# EAGLE design RobotShieldInterfaceRevB (EAGLE 7.5.0)
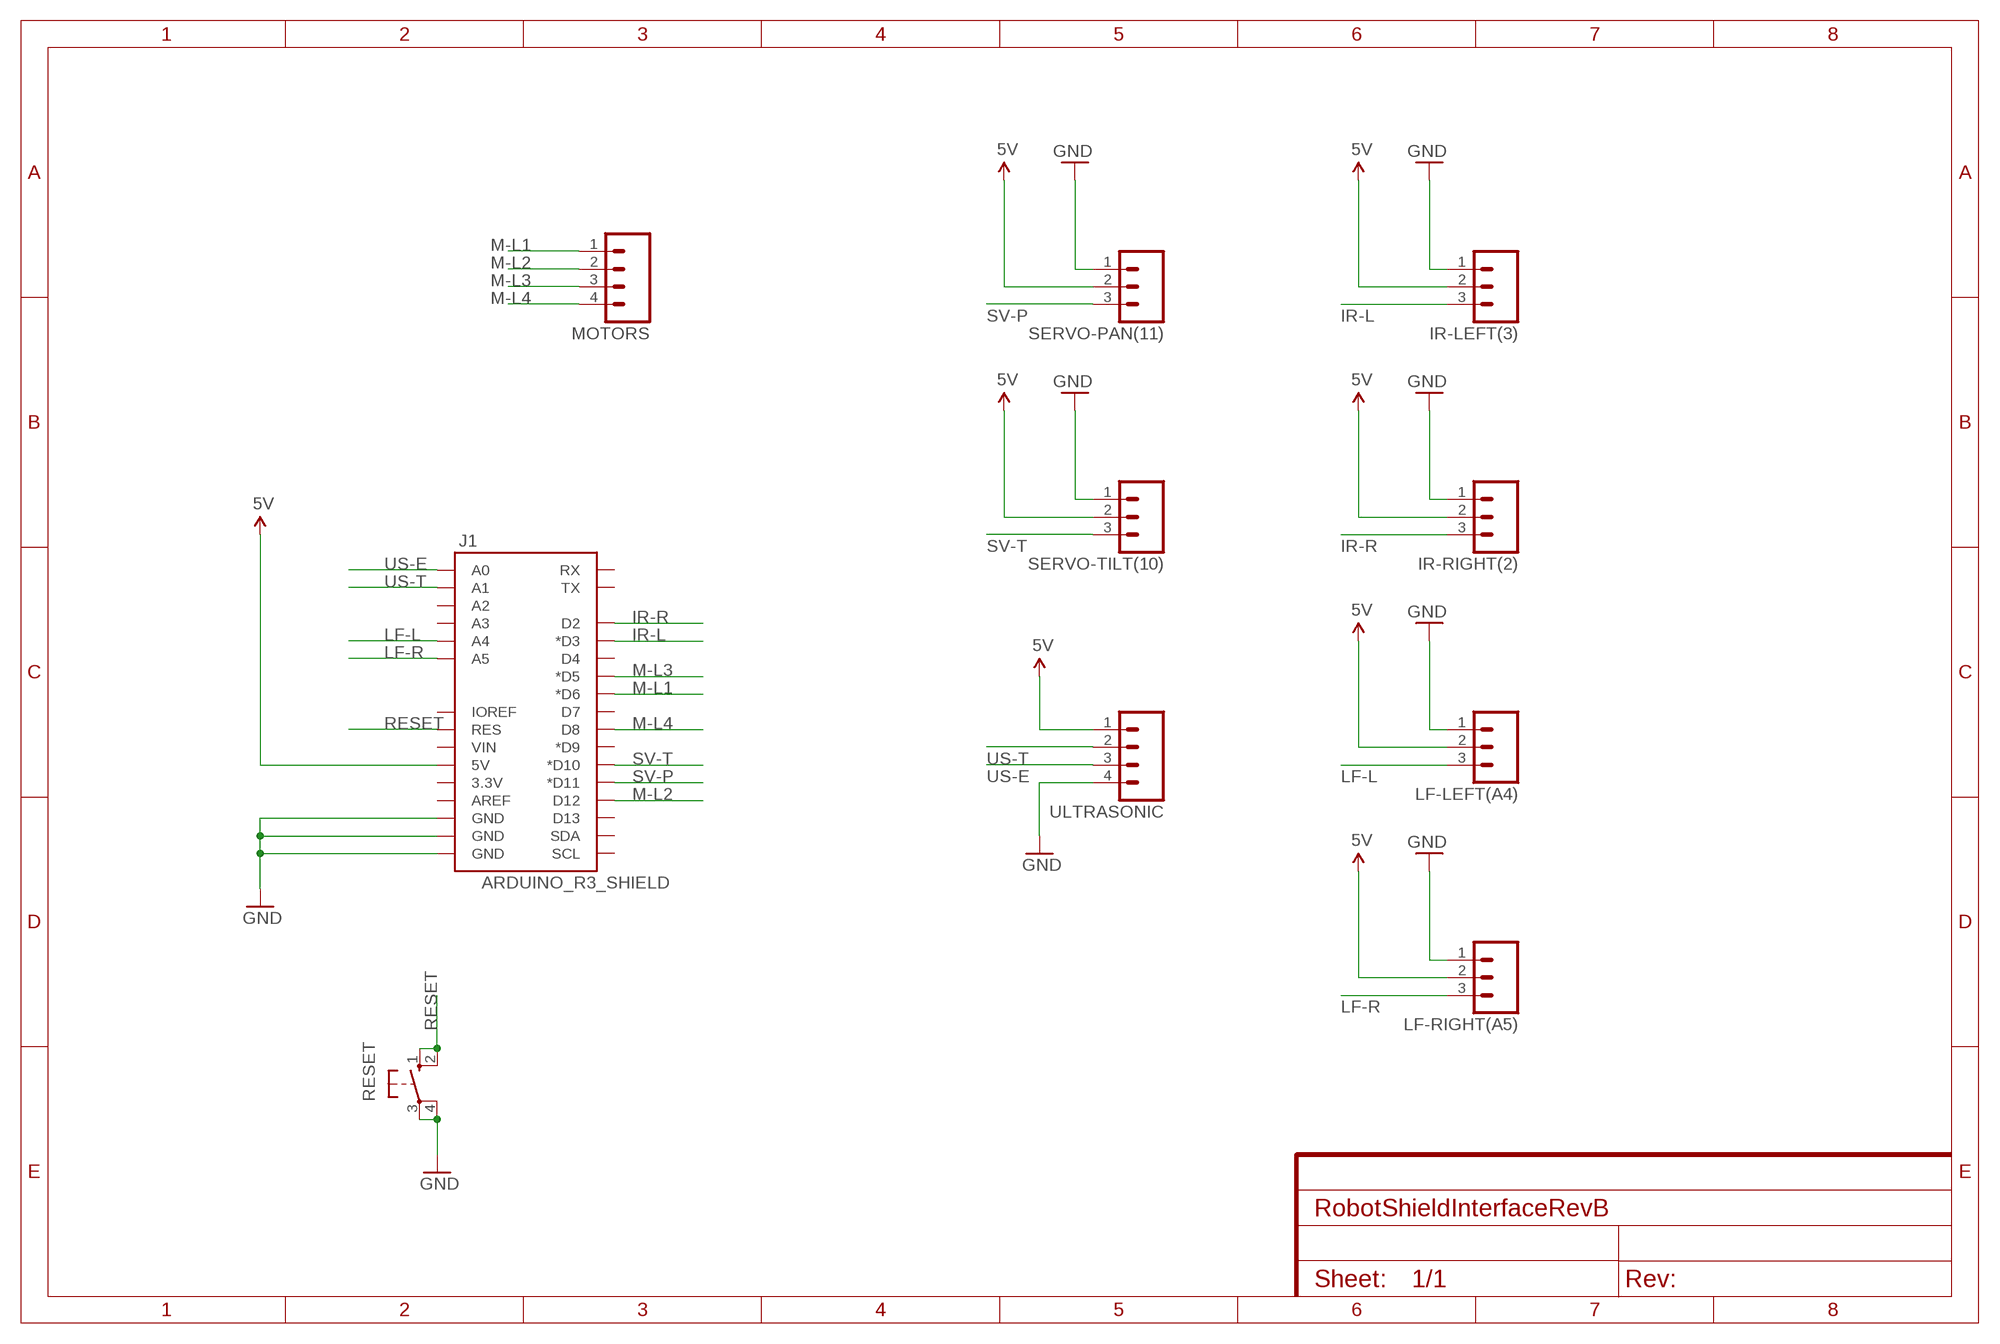
[diagram p0: schematic, sheet 1]
FRAME1 (FRAME-A4L): CNAME: Arduino Robot Interface Shield; CREVISION: B 02/2016; DESIGNER: A J Instone-Cowie

## Parts
IR-LEFT(3)  M03PTH  [1X03]
IR-RIGHT(2)  M03PTH  [1X03]
J1  ARDUINO_R3_SHIELD  [UNO_R3_SHIELD]
LF-LEFT(A4)  M03PTH  [1X03]
LF-RIGHT(A5)  M03PTH  [1X03]
MOTORS  M04PTH  [1X04]
RESET  10-XX  [B3F-10XX]
SERVO-PAN(11)  M03PTH  [1X03]
SERVO-TILT(10)  M03PTH  [1X03]
ULTRASONIC  M04PTH  [1X04]

## Nets
5V: IR-LEFT(3).2 IR-RIGHT(2).2 J1.5V LF-LEFT(A4).2 LF-RIGHT(A5).2 SERVO-PAN(11).2 SERVO-TILT(10).2 ULTRASONIC.1
GND: IR-LEFT(3).1 IR-RIGHT(2).1 J1.GND@0(GND) J1.GND@1(GND) J1.GND@2(GND) LF-LEFT(A4).1 LF-RIGHT(A5).1 RESET.3(P) RESET.4(P1) SERVO-PAN(11).1 SERVO-TILT(10).1 ULTRASONIC.4
IR-L: IR-LEFT(3).3 J1.D3(*D3)
IR-R: IR-RIGHT(2).3 J1.D2
LF-L: J1.A4 LF-LEFT(A4).3
LF-R: J1.A5 LF-RIGHT(A5).3
M-L1: J1.D6(*D6) MOTORS.1
M-L2: J1.D12 MOTORS.2
M-L3: J1.D5(*D5) MOTORS.3
M-L4: J1.D8 MOTORS.4
RESET: J1.RES RESET.1(S) RESET.2(S1)
SV-P: J1.D11(*D11) SERVO-PAN(11).3
SV-T: J1.D10(*D10) SERVO-TILT(10).3
US-E: J1.A0 ULTRASONIC.3
US-T: J1.A1 ULTRASONIC.2
Unconnected: J1.3.3V J1.A2 J1.A3 J1.AREF J1.D4 J1.D7 J1.D9(*D9) J1.D13 J1.IOREF J1.RX J1.SCL J1.SDA J1.TX J1.VIN

## Library data of the parts
IR-LEFT(3) IR-RIGHT(2) LF-LEFT(A4) LF-RIGHT(A5) SERVO-PAN(11) SERVO-TILT(10) = SparkFun-Connectors:M03: Header 3 Standard 3-pin 0.1" header. Use with straight break away headers (SKU : PRT-00116), right angle break away headers (PRT-00553), swiss pins (PRT-00743), machine pins (PRT-00117), and female headers (PRT-00115). Molex polarized connector foot print use with SKU : PRT-08232 with associated crimp pins and housings.
J1 = SparkFun-Boards:ARDUINO_R3_SHIELD: Shield form compatible with the Arduino Uno R3.
MOTORS ULTRASONIC = SparkFun-Connectors:M04: Header 4 Standard 4-pin 0.1" header. Use with straight break away headers (SKU : PRT-00116), right angle break away headers (PRT-00553), swiss pins (PRT-00743), machine pins (PRT-00117), and female headers (PRT-00115). Molex polarized connector foot print use with SKU : PRT-08231 with associated crimp pins and housings. 1MM SMD Version SKU: PRT-10208
RESET = switch-omron:10-XX: OMRON SWITCH; MPN: B3F-1000; OC_FARNELL: 176432; OC_NEWARK: 36M3542

## Board
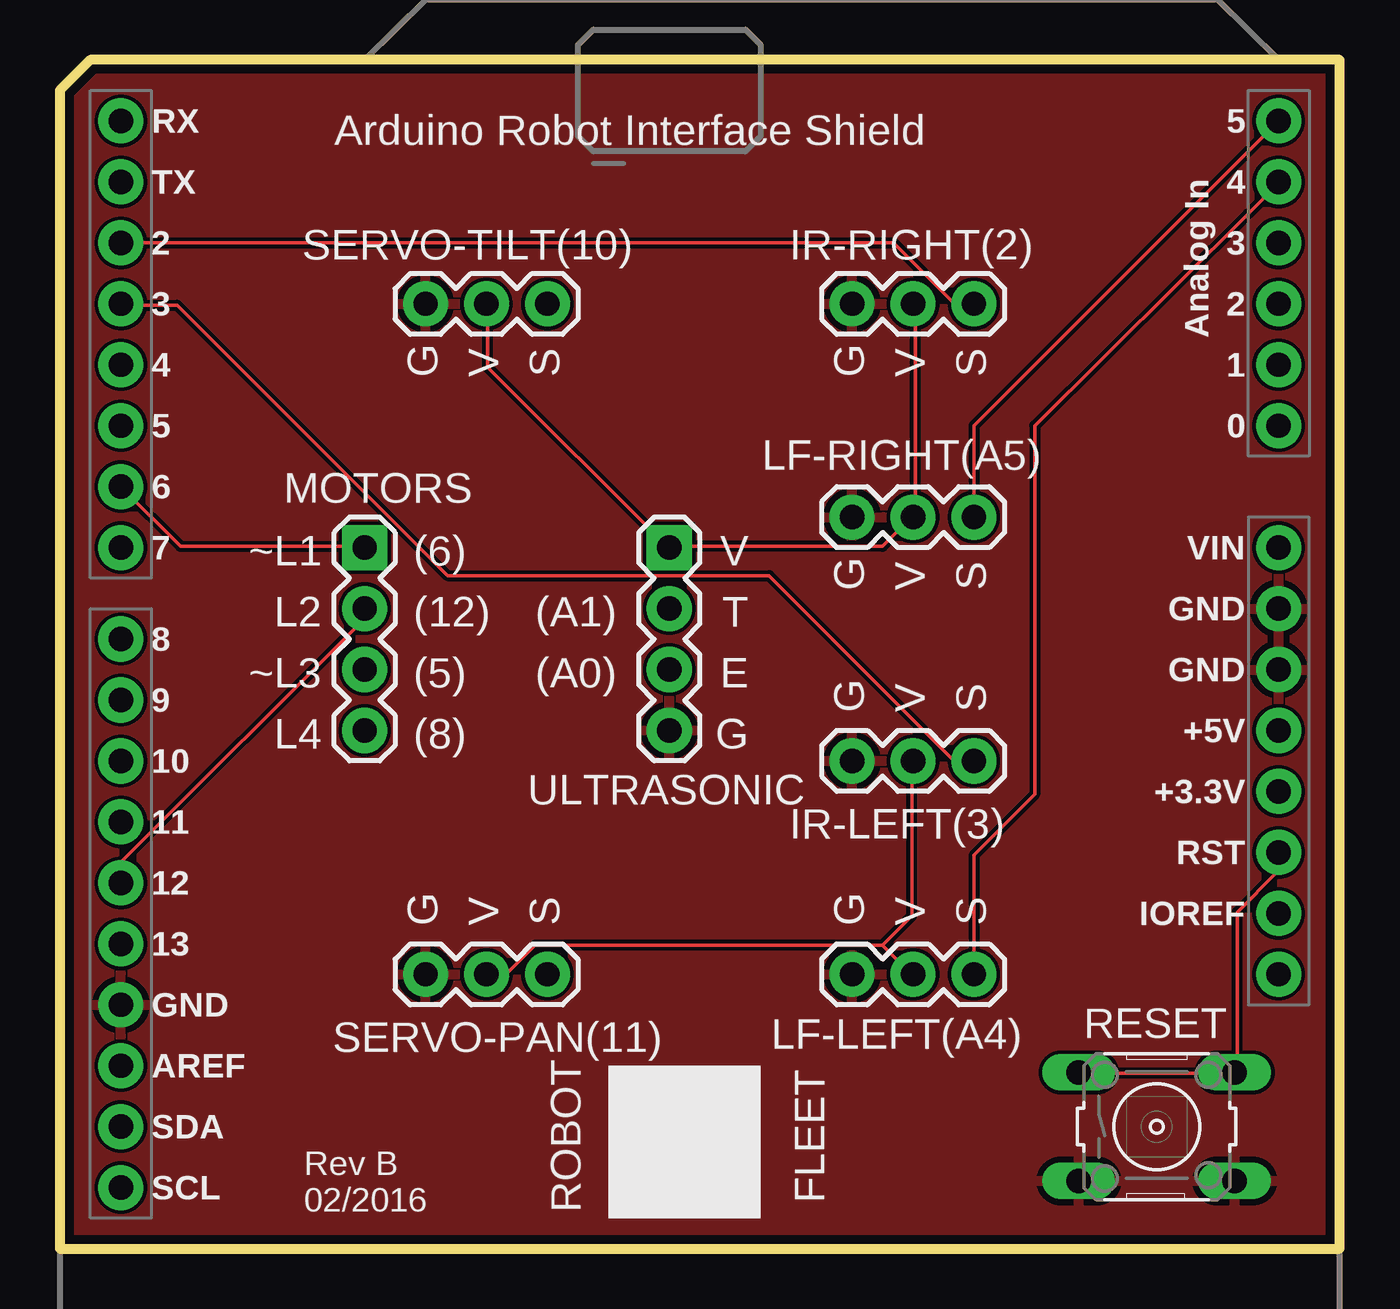
[diagram p1: board, top side]
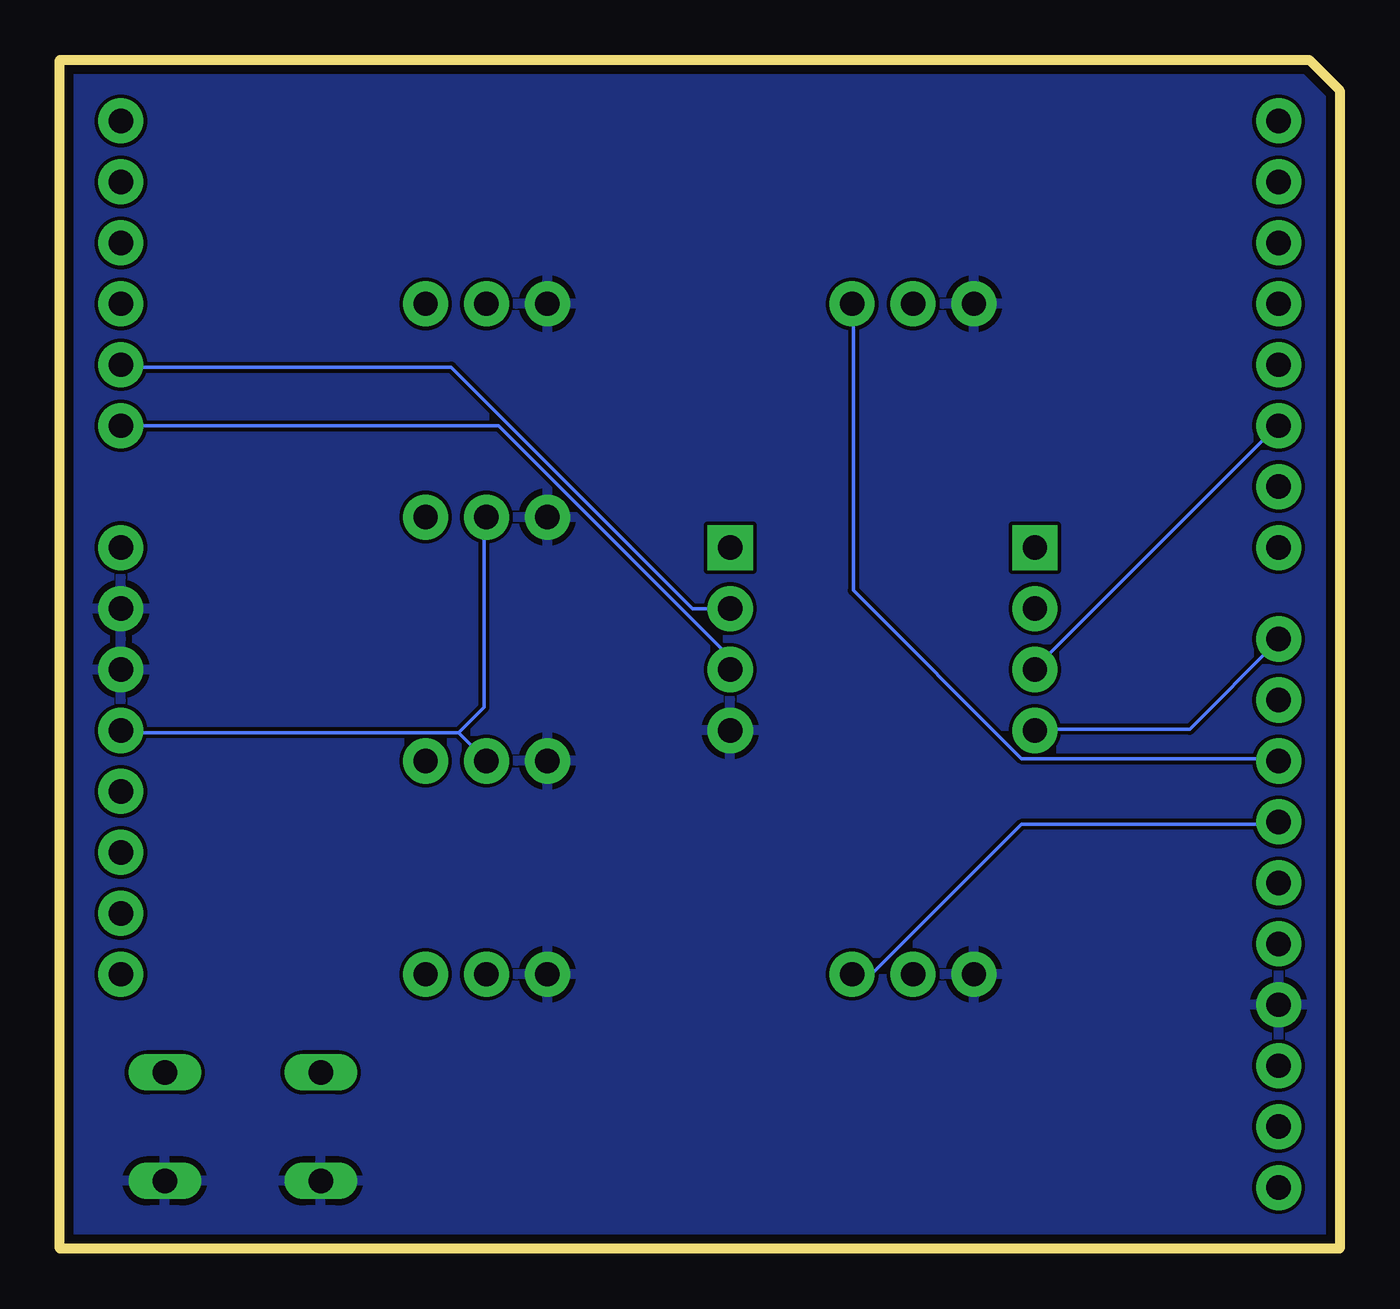
[diagram p2: board, bottom side, seen from below]

Size 53.34 x 49.53 mm. Coordinates in mm from the lower left corner, seen from the top.
Outline: 0,0 53.34,0 53.34,49.53 1.27,49.53 0,48.26 0,0
Copper layers (1*16): Top 0.0356mm / dielectric 1.5011mm / Bottom 0.0356mm
Design rules "LaenPCBOrder(OSHPARK)": minimum track width 6mil, minimum drill 13mil, track to track 6mil, track to pad 6mil, pad to pad 6mil, via to via 6mil, smd to smd 6mil, copper to edge 15mil, drill to drill 6mil, minimum pad ring 7mil, minimum via ring 7mil, stop-mask expansion 3mil, vias tented up to drill 0mil, thermal gap 10mil

### Footprints (pad centres in the part's own frame; a part is rotated, then mirrored left to right if it is on the bottom)
1X03 = drill 1.016 pad 1.88: 1 0,0; 2 2.54,0; 3 5.08,0
UNO_R3_SHIELD = drill 1.016 pad 1.88: 3.3V 50.8,26.67; 5V 50.8,29.21; A0 50.8,41.91; A1 50.8,44.45; A2 50.8,46.99; A3 50.8,49.53; A4 50.8,52.07; A5 50.8,54.61; AREF 2.54,15.24; D2 2.54,49.53; D3 2.54,46.99; D4 2.54,44.45; D5 2.54,41.91; D6 2.54,39.37; D7 2.54,36.83; D8 2.54,33.02; D9 2.54,30.48; D10 2.54,27.94; D11 2.54,25.4; D12 2.54,22.86; D13 2.54,20.32; GND@0 50.8,31.75; GND@1 50.8,34.29; GND@2 2.54,17.78; IOREF 50.8,21.59; NC 50.8,19.05; RES 50.8,24.13; RX 2.54,54.61; SCL 2.54,10.16; SDA 2.54,12.7; TX 2.54,52.07; VIN 50.8,36.83
1X04 = drill 1.016 pad 1.88 square: 1 0,0 | drill 1.016 pad 1.88: 2 2.54,0; 3 5.08,0; 4 7.62,0
B3F-10XX = drill 1.016 long: 1 -3.251,2.261; 2 3.251,2.261; 3 -3.251,-2.261; 4 3.251,-2.261

### Placement (x,y rotation side)
IR-LEFT(3)  33.02,20.32 0 top
IR-RIGHT(2)  33.02,39.37 0 top
J1  0,-7.62 0 top
LF-LEFT(A4)  33.02,11.43 0 top
LF-RIGHT(A5)  33.02,30.48 0 top
MOTORS  12.7,29.21 270 top
RESET  45.72,5.08 0 top
SERVO-PAN(11)  15.24,11.43 0 top
SERVO-TILT(10)  15.24,39.37 0 top
ULTRASONIC  25.4,29.21 270 top

### Tracks (layer width: path | path; a pad name or v marks a point on that pad's centre or on a via)
5V
  Top 0.152: SERVO-TILT(10).2 17.83,39.32 17.83,36.73 25.3,29.26 ULTRASONIC.1 25.45,29.26 34.29,29.26 35.51,30.48 LF-RIGHT(A5).2 35.66,30.48 35.66,39.32 IR-RIGHT(2).2 | SERVO-PAN(11).2 18.59,11.43 19.81,12.65 34.29,12.65 | 34.29,12.65 35.51,11.43 LF-LEFT(A4).2 | 34.29,12.65 35.51,13.87 35.51,20.27 IR-LEFT(3).2
  Bottom 0.152: 36.73,21.49 50.75,21.49 J1.5V | IR-LEFT(3).2 36.73,21.49 | 36.73,21.49 35.66,22.55 35.66,30.48 LF-RIGHT(A5).2
GND
  pour Bottom: 0,0 53.34,0 53.34,49.53 1.27,49.53 0,48.26
  pour Top: 0,0 53.34,0 53.34,49.53 1.27,49.53 0,48.26
IR-L
  Top 0.152: IR-LEFT(3).3 38.1,20.42 37.19,20.42 29.57,28.04 16.15,28.04 4.88,39.32 2.59,39.32 J1.D3
IR-R
  Top 0.152: J1.D2 34.75,41.91 37.19,39.47 38.1,39.47 IR-RIGHT(2).3
LF-L
  Top 0.152: LF-LEFT(A4).3 38.1,16.38 40.64,18.92 40.64,34.29 49.53,43.13 50.75,44.35 J1.A4
LF-R
  Top 0.152: LF-RIGHT(A5).3 38.1,34.29 J1.A5
M-L1
  Top 0.152: J1.D6 5.03,29.26 12.65,29.26 MOTORS.1
M-L2
  Top 0.152: J1.D12 2.59,15.24 2.59,16.15 12.65,26.21 12.65,26.67 MOTORS.2
M-L3
  Bottom 0.152: MOTORS.3 12.65,24.23 2.59,34.29 J1.D5
M-L4
  Bottom 0.152: MOTORS.4 12.65,21.64 6.25,21.64 2.59,25.3 J1.D8
RESET
  Top 0.152: RESET.1 42.52,7.32 48.92,7.32 RESET.2 49.07,7.47 49.07,14.02 50.75,15.7 50.75,16.46 J1.RES
SV-P
  Bottom 0.152: SERVO-PAN(11).3 19.51,11.43 13.26,17.68 2.59,17.68 J1.D11
SV-T
  Bottom 0.152: J1.D10 2.59,20.42 13.26,20.42 20.27,27.43 20.27,39.32 SERVO-TILT(10).3
US-E
  Bottom 0.152: J1.A0 35.05,34.29 25.45,24.69 25.45,24.23 ULTRASONIC.3
US-T
  Bottom 0.152: ULTRASONIC.2 26.98,26.67 37.03,36.73 50.75,36.73 J1.A1

### Text on the board
tPlace: Arduino Robot Interface Shield | G / V / S | G / V / S | G / V / S | (A1) / (A0) | G / V / S | ~L1 / L2 / ~L3 / L4 | (6) / (12) / (5) / (8) | V / T / E / G | G / V / S | G / V / S | ROBOT / / / / FLEET | Rev B / 02/2016